# Altium schematic sheet OMODRI_Encoders.SchDoc
size A3; Date: Not shown in title block; ApprovedBy: Not shown in title block; CheckedBy: Not shown in title block; Author: Not shown in title block; CompanyName: Not shown in title block; Engineer: Not shown in title block; Organization: Not shown in title block; Address1: Not shown in title block; Address2: Not shown in title block; Address3: Not shown in title block; Address4: Not shown in title block; DocumentNumber: 1; Revision: Use project parameter SCH_Rev; SheetNumber: 3; SheetTotal: 4; PageSetup: Record=PageOptions|CenterHorizontal=True|CenterVertical=True|PrintScale=1.00|XCorrection=1.00|YCorrection=1.00|PrintKind=0|BorderSize=5000000|LeftOffset=0|BottomOffset=0|Orientation=2|PaperLength=1000|PaperWidth=1000|Scale=100|PaperSource=15|PrintQuality=600|MediaType=1|DitherType=10|PaperKind=Letter|PrintScaleMode=1; CurrentTime: Not shown in title block; CurrentDate: Not shown in title block; Time: Not shown in title block; DocumentFullPathAndName: Not shown in title block; DocumentName: Not shown in title block; ModifiedDate: Not shown in title block; ImagePath: Not shown in title block
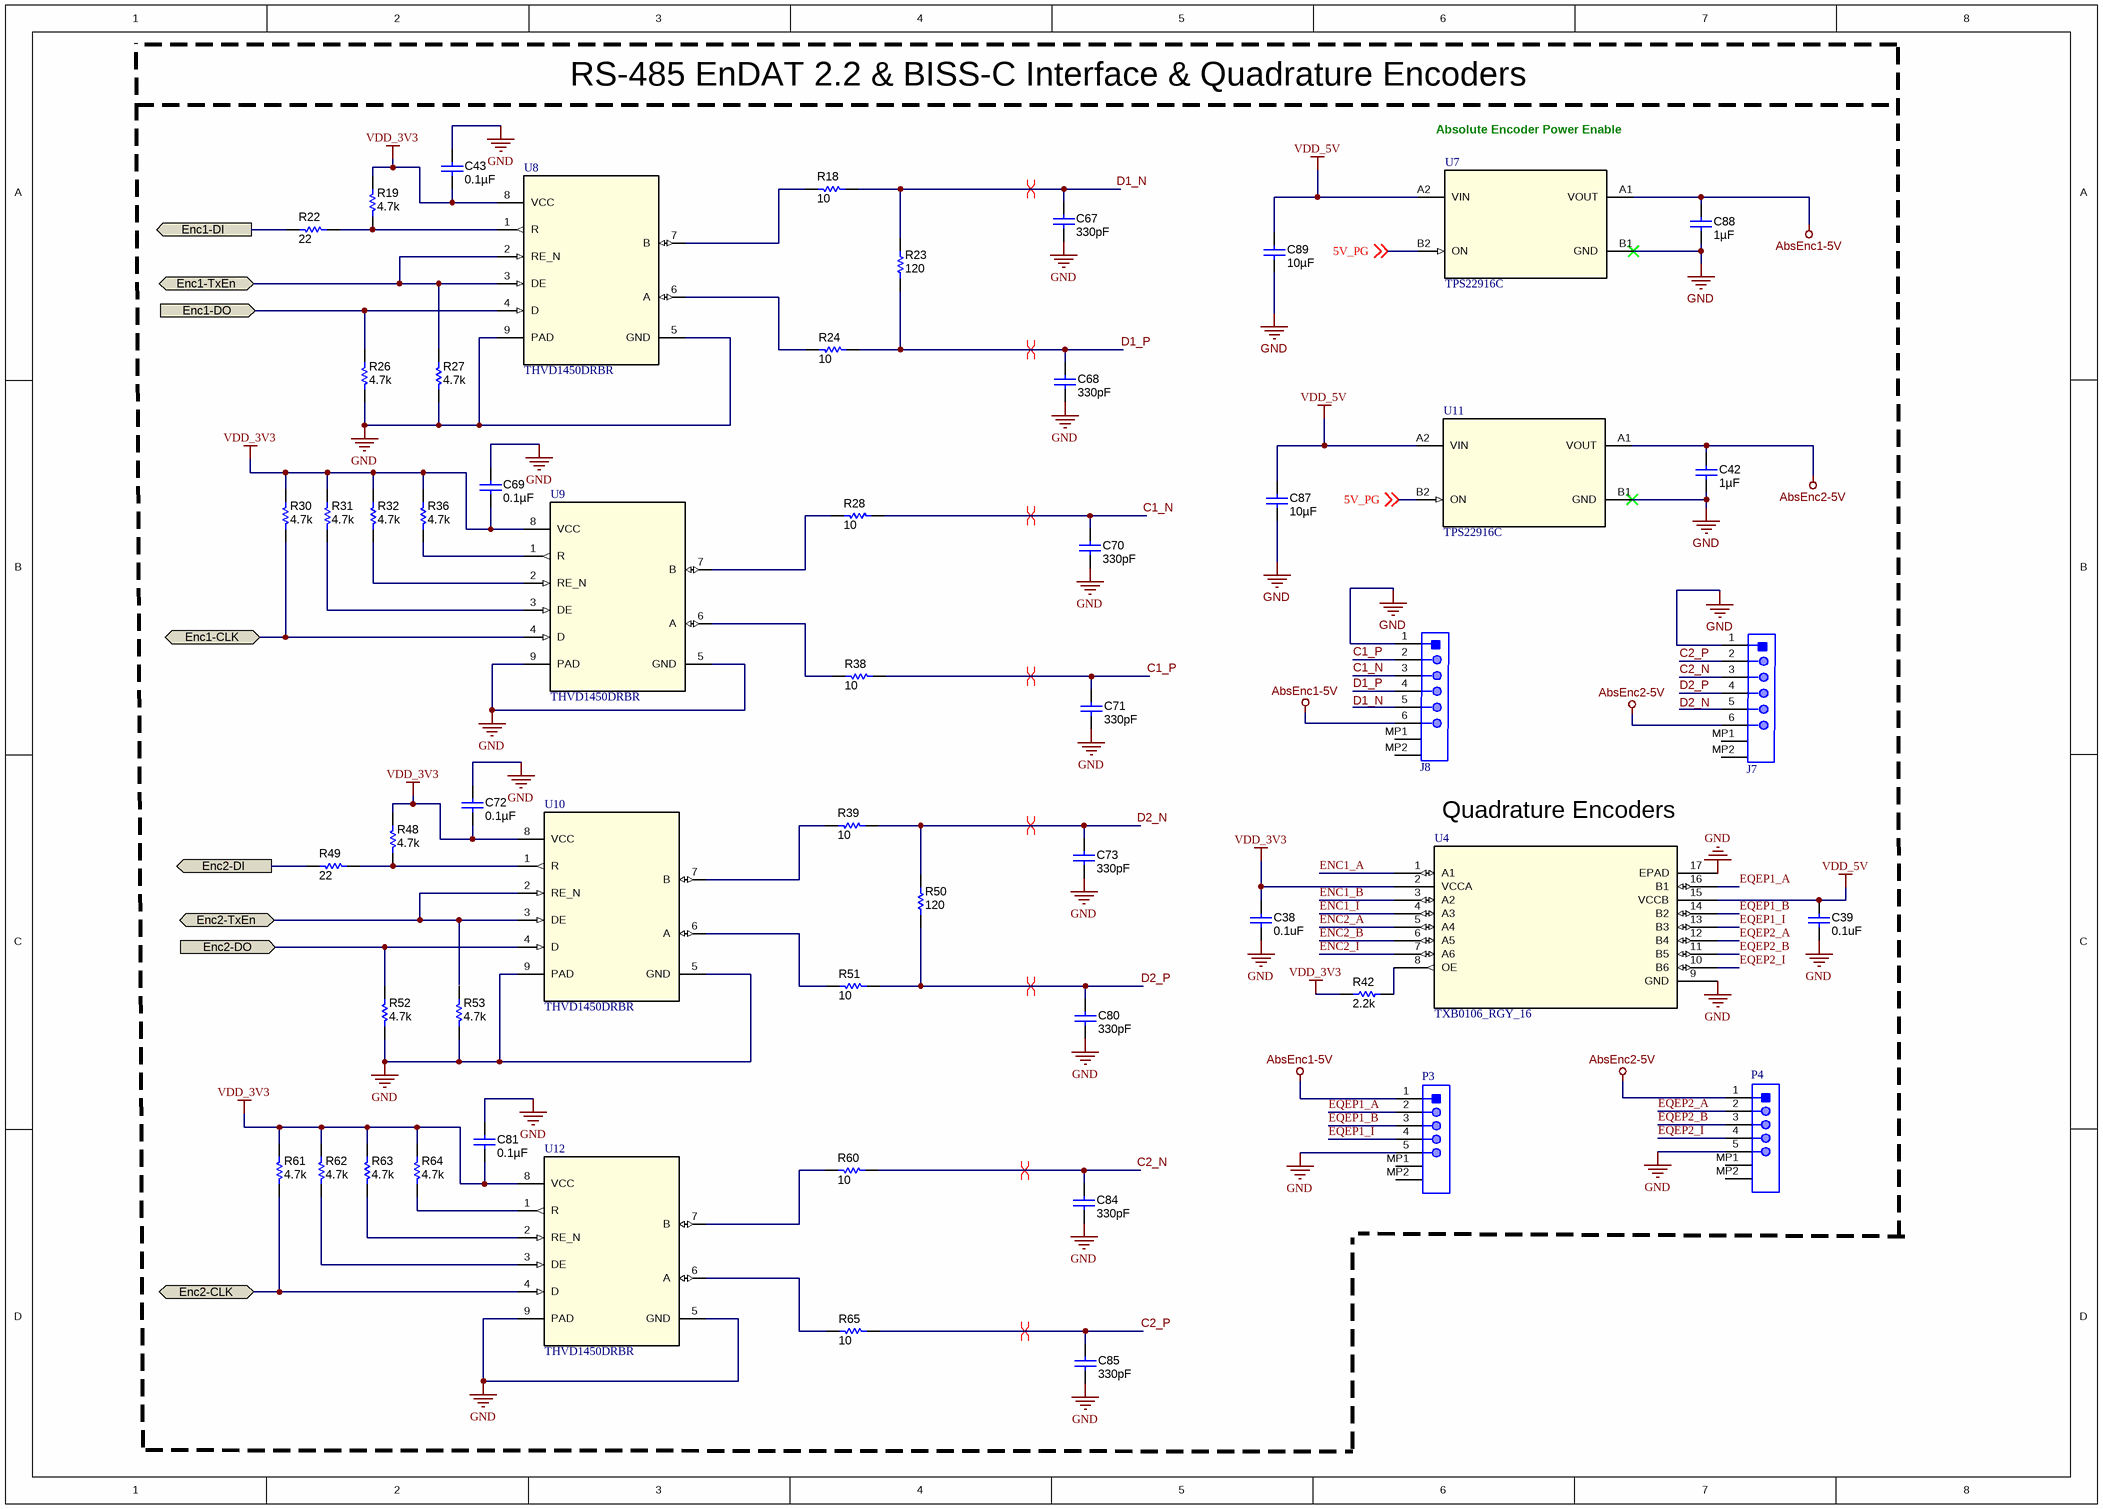
[diagram p0: OMODRI_Encoders.SchDoc]

## Parts
C38  ValueDisplayed: 0.1uF  [0402]  (hidden comment: CL05B104KP5NNNC)
C39  ValueDisplayed: 0.1uF  [0402]  (hidden comment: CL05B104KP5NNNC)
C42  ValueDisplayed: 1µF  [0805_HV]  (hidden comment: TMK212BJ105KG-T)
C43  ValueDisplayed: 0.1µF  [0603]  (hidden comment: 06033D104KAT2A)
C67  ValueDisplayed: 330pF  [0603]  (hidden comment: GRM188R71H331KA01D)
C68  ValueDisplayed: 330pF  [0603]  (hidden comment: GRM188R71H331KA01D)
C69  ValueDisplayed: 0.1µF  [0603]  (hidden comment: 06033D104KAT2A)
C70  ValueDisplayed: 330pF  [0603]  (hidden comment: GRM188R71H331KA01D)
C71  ValueDisplayed: 330pF  [0603]  (hidden comment: GRM188R71H331KA01D)
C72  ValueDisplayed: 0.1µF  [0603]  (hidden comment: 06033D104KAT2A)
C73  ValueDisplayed: 330pF  [0603]  (hidden comment: GRM188R71H331KA01D)
C80  ValueDisplayed: 330pF  [0603]  (hidden comment: GRM188R71H331KA01D)
C81  ValueDisplayed: 0.1µF  [0603]  (hidden comment: 06033D104KAT2A)
C84  ValueDisplayed: 330pF  [0603]  (hidden comment: GRM188R71H331KA01D)
C85  ValueDisplayed: 330pF  [0603]  (hidden comment: GRM188R71H331KA01D)
C87  ValueDisplayed: 10µF  [0805_HV]  (hidden comment: GRM21BR61E106KA73L)
C88  ValueDisplayed: 1µF  [0805_HV]  (hidden comment: TMK212BJ105KG-T)
C89  ValueDisplayed: 10µF  [0805_HV]  (hidden comment: GRM21BR61E106KA73L)
J7  Conn_JST_BM06B-GHS-TBT_LF_SN_N_eec  [JST_BM06B-GHS-TBT_LF_SN_N_0]  (value not drawn)
J8  Conn_JST_BM06B-GHS-TBT_LF_SN_N_eec  [JST_BM06B-GHS-TBT_LF_SN_N_0]  (value not drawn)
P3  BM05B-GHS-TBT(LF)(SN)  [JST-BM05B-GHS-TBT_V]  (value not drawn)
P4  BM05B-GHS-TBT(LF)(SN)  [JST-BM05B-GHS-TBT_V]  (value not drawn)
R18  value 10  [0603]  (hidden comment: CRCW060310R0JNEAHP)
R19  value 4.7k  [0603]  (hidden comment: CRCW06034K70JNEA)
R22  value 22  [0603]  (hidden comment: CRCW060322R0JNEA)
R23  ValueDisplayed: 120  [0603]  (hidden comment: CRCW0603120RJNEA)
R24  value 10  [0603]  (hidden comment: CRCW060310R0JNEAHP)
R26  value 4.7k  [0603]  (hidden comment: CRCW06034K70JNEA)
R27  value 4.7k  [0603]  (hidden comment: CRCW06034K70JNEA)
R28  value 10  [0603]  (hidden comment: CRCW060310R0JNEAHP)
R30  value 4.7k  [0603]  (hidden comment: CRCW06034K70JNEA)
R31  value 4.7k  [0603]  (hidden comment: CRCW06034K70JNEA)
R32  value 4.7k  [0603]  (hidden comment: CRCW06034K70JNEA)
R36  value 4.7k  [0603]  (hidden comment: CRCW06034K70JNEA)
R38  value 10  [0603]  (hidden comment: CRCW060310R0JNEAHP)
R39  value 10  [0603]  (hidden comment: CRCW060310R0JNEAHP)
R42  ValueDisplayed: 2.2k  [0201]  (hidden comment: CRCW02012K20JNED)
R48  value 4.7k  [0603]  (hidden comment: CRCW06034K70JNEA)
R49  value 22  [0603]  (hidden comment: CRCW060322R0JNEA)
R50  ValueDisplayed: 120  [0603]  (hidden comment: CRCW0603120RJNEA)
R51  value 10  [0603]  (hidden comment: CRCW060310R0JNEAHP)
R52  value 4.7k  [0603]  (hidden comment: CRCW06034K70JNEA)
R53  value 4.7k  [0603]  (hidden comment: CRCW06034K70JNEA)
R60  value 10  [0603]  (hidden comment: CRCW060310R0JNEAHP)
R61  value 4.7k  [0603]  (hidden comment: CRCW06034K70JNEA)
R62  value 4.7k  [0603]  (hidden comment: CRCW06034K70JNEA)
R63  value 4.7k  [0603]  (hidden comment: CRCW06034K70JNEA)
R64  value 4.7k  [0603]  (hidden comment: CRCW06034K70JNEA)
R65  value 10  [0603]  (hidden comment: CRCW060310R0JNEAHP)
U4  TXB0106_RGY_16  [RGY16_2P55X2P05]
U7  TPS22916C  [YFP0004ABAB]
U8  THVD1450DRBR  [DRB0008F]
U9  THVD1450DRBR  [DRB0008F]
U10  THVD1450DRBR  [DRB0008F]
U11  TPS22916C  [YFP0004ABAB]
U12  THVD1450DRBR  [DRB0008F]

## Ports
Enc1-CLK (bidir), Enc1-DI (out), Enc1-DO (in), Enc1-TxEn (bidir), Enc2-CLK (bidir), Enc2-DI (out), Enc2-DO (in), Enc2-TxEn (bidir)

## Nets
AbsEnc1-5V: C88.1 J8.6 P3.1 U7.A1(VOUT)
AbsEnc2-5V: C42.1 J7.6 P4.1 U11.A1(VOUT)
GND: C38.2 C39.2 C42.2 C43.2 C67.1 C68.2 C69.2 C70.1 C71.2 C72.2 C73.1 C80.2 C81.2 C84.1 C85.2 C87.2 C88.2 C89.2 J7.1 J8.1 P3.5 P4.5 R26.2 R27.2 R52.2 R53.2 U4.9(GND) U4.17(EPAD) U7.B1(GND) U8.5(GND) U8.9(PAD) U9.5(GND) U9.9(PAD) U10.5(GND) U10.9(PAD) U11.B1(GND) U12.5(GND) U12.9(PAD)
VDD_3V3: C38.1 C43.1 C69.1 C72.1 C81.1 R19.2 R30.1 R31.1 R32.1 R36.1 R42.1 R48.2 R61.1 R62.1 R63.1 R64.1 U4.2(VCCA) U8.8(VCC) U9.8(VCC) U10.8(VCC) U12.8(VCC)
VDD_5V: C39.1 C87.1 C89.1 U4.15(VCCB) U7.A2(VIN) U11.A2(VIN)
5V_PG: U7.B2(ON) U11.B2(ON) ; off-sheet 5V_PG
C1_N: C70.2 J8.3 R28.1
C1_P: C71.1 J8.2 R38.1
C2_N: C84.2 J7.3 R60.1
C2_P: C85.1 J7.2 R65.1
D1_N: C67.2 R18.1 R23.2
D1_P: C68.1 J8.4 R23.1 R24.1
D2_N: C73.2 R39.1 R50.2
D2_P: C80.1 J7.4 R50.1 R51.1
Enc1-CLK: R30.2 U9.4(D) ; port Enc1-CLK
Enc1-DI: R22.2 ; port Enc1-DI
Enc1-DO: R26.1 U8.4(D) ; port Enc1-DO
Enc1-TxEn: U8.2(RE_N) U8.3(DE) ; port Enc1-TxEn
ENC1_A: U4.1(A1)
ENC1_B: U4.3(A2)
ENC1_I: U4.4(A3)
Enc2-CLK: R61.2 U12.4(D) ; port Enc2-CLK
Enc2-DI: R49.2 ; port Enc2-DI
Enc2-DO: R52.1 U10.4(D) ; port Enc2-DO
Enc2-TxEn: U10.2(RE_N) U10.3(DE) ; port Enc2-TxEn
ENC2_A: U4.5(A4)
ENC2_B: U4.6(A5)
ENC2_I: U4.7(A6)
EQEP1_A: P3.2 U4.16(B1)
EQEP1_B: P3.3 U4.14(B2)
EQEP1_I: P3.4 U4.13(B3)
EQEP2_A: P4.2 U4.12(B4)
EQEP2_B: P4.3 U4.11(B5)
EQEP2_I: P4.4 U4.10(B6)
NetR18_2: R18.2 U8.7(B)
NetR19_1: R19.1 R22.1 U8.1(R)
NetR24_2: R24.2 U8.6(A)
NetR28_2: R28.2 U9.7(B)
NetR31_2: R31.2 U9.3(DE)
NetR32_2: R32.2 U9.2(RE_N)
NetR36_2: R36.2 U9.1(R)
NetR38_2: R38.2 U9.6(A)
NetR39_2: R39.2 U10.7(B)
NetR42_2: R42.2 U4.8(OE)
NetR48_1: R48.1 R49.1 U10.1(R)
NetR51_2: R51.2 U10.6(A)
NetR60_2: R60.2 U12.7(B)
NetR62_2: R62.2 U12.3(DE)
NetR63_2: R63.2 U12.2(RE_N)
NetR64_2: R64.2 U12.1(R)
NetR65_2: R65.2 U12.6(A)

Not connected (* = marked no-connect by the designer): J7 5 MP1 MP2; J8 5 MP1 MP2; P3 MP1 MP2; P4 MP1 MP2; R27 1; R53 1

## Layout directives
differential pair: C1_N, C1_P, C2_N, C2_P, D1_N, D1_P, D2_N, D2_P

## Notes on the sheet
- RS-485 EnDAT 2.2 & BISS-C Interface & Quadrature Encoders
- Absolute Encoder Power Enable
- Quadrature Encoders
- Labels drawn without touching a wire or pin: D1_N, D2_N
- Drawn By:
- SVN Rev:
- Number:
- TID #:
- Orderable:
- Rev:
- Sheet Title:
- File:
- Project Title:
- Designed for:
- Assembly Variant:
- Mod. Date:
- Sheet:
- Size:
- of
- B
- http://www.ti.com
- Texas Instruments and/or its licensors do not warrant the accuracy or completeness of this specification or any information contained therein. Texas Instruments and/or its licensors do not warrant that this design will meet the specifications, will be suitable for your application or fit for any particular purpose, or will operate in an implementation. Texas Instruments and/or its licensors do not warrant that the design is production worthy. You should completely validate and test your design implementation to confirm the system functionality for your application.
- Engineer:
- Contact:
- © Texas Instruments

## Library data of the parts
C38 C39 = CMP-0006343-2: CAP, CERM, 0.1 uF, 10 V, +/- 10%, X7R, 0402; Manufacturer: Samsung Electro-Mechanics; Polarized: N; Value: 0.1uF; U/M: EA; Cap_F: 100nF; Value1: Unknown; VDC_V: 10V; TaMin_C: -55°C; TaMax_C: 125°C; AEC Category: Q200; SizeArea_mm2: 0.5; SizeAreaWB_mm2: 3; SizeX_mm: 1; SizeZ_mm: 0.6; CompType: Capacitor; PartNumber: CL05B104KP5NNNC; PackageReference: 0402; RoHS: Y; Tolerance_%: 10%; Value2: 10V; MountType: SMT; Technology: Ceramic; TempCo: X7R; Cap_Case: 0402; Published: 2008-06-19; Publisher: Texas Instruments; LatestRevisionDate: 2017-03-09; ComponentLink1Description: Datasheet link; ComponentLink1URL: http://www.samsungsem.com/kr/front/downloadcms.do?path=/kr/support/product-search/mlcc/__icsFiles/afieldfile/2014/11/05&fileName=S_CL05B104KP5NNNC.pdf; AEC Qualified: N; AEC Grade: N/A; SizeY_mm: 0.5
C42 C88 = TMK212BJ105KG-T: CAP, CERM, 1 µF, 20 V, +/- 10%, X5R, 0805; Manufacturer: Taiyo Yuden; Polarized: N; CompType: Capacitor; Value: 1uF; U/M: EA; Cap_F: 0.000001; Tolerance_%: 10; Value1: Unknown; VDC_V: 20; Value2: 20V; TaMin_C: -55; TaMax_C: 85; Cap_Case: 0805; SizeArea_mm2: 2.5; SizeAreaWB_mm2: 6.75; SizeX_mm: 2; SizeY_mm: 1.25; SizeZ_mm: 1.45; AEC Category: Q200; SymbolVersion: 2008-07-09; PartNumber: TMK212BJ105KG-T; PackageReference: 0805; RoHS: Y; MountType: SMT; Technology: Ceramic; TempCo: X5R; Published: 2008-06-19; Publisher: Texas Instruments; LatestRevisionDate: 2016-07-16; ComponentLink1Description: Datasheet link; ComponentLink1URL: http://www.yuden.co.jp/ut/product/pdf/djmk_e.pdf; Supplier 1: Digi-Key; Supplier Part Number 1: 587-1291-1-ND; Supplier 2: Farnell; Supplier Part Number 2: 8031575; Supplier 3: Newark; Supplier Part Number 3: 18J2754; AEC Qualified: ?
C43 C69 C72 C81 = 06033D104KAT2A: CAP, CERM, 0.1uF, 25V, +/-10%, X5R, 0603; Manufacturer: AVX; Polarized: N; CompType: Capacitor; U/M: EA; Cap_F: 0.0000001; Tolerance_%: 10; ESR_Ohm: 0.048; Value1: 0.048 ohm; VDC_V: 25; IRMS_A: 0.53; TaMin_C: -55; TaMax_C: 85; SymbolVersion: 2008-07-09; Value: 0.1uF; PartNumber: 06033D104KAT2A; PackageReference: 0603; RoHS: Y; Value2: 25V; MountType: SMT; Technology: Ceramic; TempCo: X5R; Cap_Case: 0603; Published: 2008-06-19; Publisher: Texas Instruments; LatestRevisionDate: 2014-03-28; ComponentLink1Description: Datasheet link; ComponentLink1URL: http://www.avx.com/docs/masterpubs/smccp.pdf; Supplier 1: Digi-Key; Supplier Part Number 1: 478-1244-1-ND; Supplier 2: Mouser; Supplier Part Number 2: 581-06033D104K
C67 C68 C70 C71 C73 C80 C84 C85 = GRM188R71H331KA01D: CAP, CERM, 330pF, 50V, +/-10%, X7R, 0603; Manufacturer: MuRata; Polarized: N; CompType: Capacitor; U/M: EA; Cap_F: 0.00000000033; Tolerance_%: 10; Value1: Unknown; VDC_V: 50; TaMin_C: -55; TaMax_C: 125; SymbolVersion: 2008-07-09; Value: 330pF; PartNumber: GRM188R71H331KA01D; PackageReference: 0603; RoHS: Y; Value2: 50V; MountType: SMT; Technology: Ceramic; TempCo: X7R; Cap_Case: 0603; Published: 2008-06-19; Publisher: Texas Instruments; LatestRevisionDate: 2014-03-28; ComponentLink1Description: Datasheet link; ComponentLink1URL: http://search.murata.co.jp/Ceramy/PnsearchViewAction.do?HnOFG=ON&HnNFG=ON&SEL_CNT=50&sLang=en&sKey=GRM188R71H331KA01D&x=9&y=9&search=startwith; Supplier 1: Digi-Key; Supplier Part Number 1: 490-1486-1-ND; Supplier 2: Mouser; Supplier Part Number 2: 81-GRM188R71H331KA01; Supplier 3: Farnell; Supplier Part Number 3: 1403787
C87 C89 = GRM21BR61E106KA73L: CAP, CERM, 10 µF, 25 V,+/- 10%, X5R, 0805; Manufacturer: MuRata; Polarized: N; CompType: Capacitor; Value: 10uF; U/M: EA; Cap_F: 0.00001; Tolerance_%: 10; Value1: Unknown; VDC_V: 25; Value2: 25V; TaMin_C: -55; TaMax_C: 85; Cap_Case: 0805; SizeArea_mm2: 2.5; SizeAreaWB_mm2: 6.75; SizeX_mm: 2; SizeY_mm: 1.25; SizeZ_mm: 1.45; AEC Category: Q200; Green_Lifecycle: Active; Green_REACh: Passed; SymbolVersion: 2008-07-09; PartNumber: GRM21BR61E106KA73L; PackageReference: 0805; RoHS: Y; MountType: SMT; Technology: Ceramic; TempCo: X5R; Published: 2008-06-19; Publisher: Texas Instruments; LatestRevisionDate: 2017-06-02; ComponentLink1Description: Datasheet link; ComponentLink1URL: http://www.murata.com/~/media/webrenewal/support/library/catalog/products/capacitor/mlcc/c02e.ashx; Supplier 1: Digi-Key; Supplier Part Number 1: 490-5523-1-ND; Supplier 2: Newark; Supplier Part Number 2: 24R6339; Supplier 3: Mouser; Supplier Part Number 3: 81-GRM21BR61E106KA3L; AEC Qualified: ?; Green_EU RoHS: Passed; Green_EU RoHS-2: Incomplete
J7 J8 = Conn_JST_BM06B-GHS-TBT_LF_SN_N_eec: CONN HEADER GH TOP 6POS 1.25MM; Manufacturer: JST; Part Number: BM06B-GHS-TBT(LF)(SN)(N); helpURL: https://upverter.com/upn/revision/9caaf2120726c690/; ComponentLink2Description: Datasheet; Temperature: -25°C to +85°C; Package: HDR06; Supplier 2: Mouser; Price: 0.396190066284; Supplier 1: Digi-Key; ComponentLink1URL: https://upverter.com/upn/revision/9caaf2120726c690/; Supplier Part Number 1: 455-1582-1-ND; ComponentLink1Description: Upverter; ComponentLink2URL: http://www.jst-mfg.com/product/pdf/eng/eGH.pdf; RoHS: TRUE; Temperature Range High: +85°C; Digikey Description: CONN HEADER GH TOP 6POS 1.25MM; Digikey Part Number: 455-1582-1-ND; Temperature Range Low: -25°C; Lead Free: yes
P3 P4 = CMP-2000-05958-1: GH Disconnectable Crimp Style Connector, Pitch 1.25 mm, 1 x 5 Position, Height 4.05 mm, -25 to 85 degC, RoHS, Tape and Reel; Manufacturer: JST; No of Positions: 5; Pitch: 1.25mm; Style/Orientation: StraightHeader/Plug; Package Reference: BM05B-GHS-TBT; Type: WiretoBoard; Datasheet URL: http://www.jst-mfg.com/product/pdf/eng/eGH.pdf; Termination: Crimp; Manufacturer URL: http://www.jst.com/home2.html; Mounting Technology: SurfaceMount; Datasheet Version: 05/2016; Package Description: GH Disconnectable Crimp Style Connector, Pitch 1.25 mm, 1 x 5 Position, Height 4.05 mm
R18 R24 R28 R38 R39 R51 R60 R65 = CRCW060310R0JNEAHP: RES, 10 ohm, 5%, 0.25W, 0603; Manufacturer: Vishay-Dale; CompType: Resistor; Value_Code: 10R0; Tolerance_%: 5; Power_W: 0.25; VDC_V: 75; TempCo: 200 ppm/C; EIA_Code: E24; U/M: EA; SymbolVersion: 2009-05-29; PartNumber: CRCW060310R0JNEAHP; PackageReference: 0603; RoHS: Y; Res_ohm: 10; Value1: 5%; Value2: 0.25W; MountType: SMT; Technology: Thick Film; Published: 2008-06-26; Publisher: Texas Instruments; LatestRevisionDate: 2014-03-15; ComponentLink1Description: Datasheet link; ComponentLink1URL: http://www.vishay.com/docs/20043/crcwhpe3.pdf; Supplier 1: Digi-Key; Supplier Part Number 1: 541-10SACT-ND; Supplier 2: Mouser; Supplier Part Number 2: 71-CRCW060310R0JNEAH; Supplier 3: Farnell; Supplier Part Number 3: 24T7074
R19 R26 R27 R30-R32 R36 R48 R52 R53 R61-R64 = CRCW06034K70JNEA: RES, 4.7k ohm, 5%, 0.1W, 0603; Manufacturer: Vishay-Dale; CompType: Resistor; Res_ohm: 4700; Value_Code: 4k70; Tolerance_%: 5; Power_W: 0.1; VDC_V: 75; TempCo: 200 ppm/C; EIA_Code: E24; U/M: EA; SymbolVersion: 2009-05-29; PartNumber: CRCW06034K70JNEA; PackageReference: 0603; RoHS: Y; Value1: 5%; Value2: 0.1W; MountType: SMT; Technology: Thick Film; Published: 2008-06-26; Publisher: Texas Instruments; LatestRevisionDate: 2014-03-15; ComponentLink1Description: Datasheet link; ComponentLink1URL: http://www.vishay.com/docs/20035/dcrcwe3.pdf; Supplier 1: Mouser; Supplier Part Number 1: 71-CRCW0603J-4.7K-E3; Supplier 2: Farnell; Supplier Part Number 2: 1652884; Supplier 3: Newark; Supplier Part Number 3: 59M6811
R22 R49 = CRCW060322R0JNEA: RES, 22 ohm, 5%, 0.1W, 0603; Manufacturer: Vishay-Dale; CompType: Resistor; Value_Code: 22R0; Tolerance_%: 5; Power_W: 0.1; VDC_V: 75; TempCo: 200 ppm/C; EIA_Code: E24; U/M: EA; SymbolVersion: 2009-05-29; PartNumber: CRCW060322R0JNEA; PackageReference: 0603; RoHS: Y; Res_ohm: 22; Value1: 5%; Value2: 0.1W; MountType: SMT; Technology: Thick Film; Published: 2008-06-26; Publisher: Texas Instruments; LatestRevisionDate: 2014-04-07; ComponentLink1Description: Datasheet link; ComponentLink1URL: http://www.vishay.com/docs/20035/dcrcwe3.pdf; Supplier 1: Digi-Key; Supplier Part Number 1: 541-22GCT-ND; Supplier 2: Mouser; Supplier Part Number 2: 71-CRCW0603J-22-E3; Supplier 3: Farnell; Supplier Part Number 3: 1692521
R23 R50 = CRCW0603120RJNEA: RES, 120, 5%, 0.1 W, 0603; Manufacturer: Vishay-Dale; CompType: Resistor; Value: 120; Value_Code: 120R; Tolerance_%: 5; Power_W: 0.1; Value2: 0.1W; VDC_V: 75; TempCo: 200 ppm/C; SizeArea_mm2: 1.28; SizeX_mm: 1.6; SizeY_mm: 0.8; SizeZ_mm: 1; EIA_Code: E24; U/M: EA; AEC Category: Q200; SymbolVersion: 2009-05-29; PartNumber: CRCW0603120RJNEA; PackageReference: 0603; RoHS: Y; Res_ohm: 120; Value1: 5%; MountType: SMT; Technology: Thick Film; Published: 2008-06-26; Publisher: Texas Instruments; LatestRevisionDate: 2016-06-29; ComponentLink1Description: Datasheet link; ComponentLink1URL: http://www.vishay.com/docs/20035/dcrcwe3.pdf; Supplier 1: Digi-Key; Supplier Part Number 1: 541-120GCT-ND; Supplier 2: Mouser; Supplier Part Number 2: 71-CRCW0603J-120-E3; Supplier 3: Farnell; Supplier Part Number 3: 1514716; AEC Qualified: ?
R42 = CMP-0027010-2: RES, 2.2 k, 5%, 0.05 W, 0201; Manufacturer: Vishay-Dale; Power_W: 50mW; TempCo: 200 ppm/C; Value_Code: 2k20; Value: 2.2k; EIA_Code: E24; SizeX_mm: 0.6; SizeY_mm: 0.3; SizeZ_mm: 0.26; Value2: 0.05W; SizeArea_mm2: 0.18; AEC Qualified: N; VDC_V: 30V; AEC Category: Q200; ComponentLink1URL: http://www.vishay.com/docs/20052/crcw0201e3.pdf; Supplier Part Number 2: 48P7324; Supplier 2: Newark; Supplier Part Number 3: 71-CRCW02012K20JNED; Supplier 3: Mouser; RoHS: E; Value1: 5%; MountType: SMT; Supplier 1: Digi-Key; PackageReference: 0201; Tolerance_%: 5%; Res_ohm: 2.2k; CompType: Resistor; PartNumber: CRCW02012K20JNED; ComponentLink1Description: Datasheet link; AEC Grade: N/A; Supplier Part Number 1: 541-2.2KAGCT-ND; Technology: Thick Film
U4 = TXB0106_RGY_16: Vendor: Texas Instruments; PACKAGE_DESIGNATOR: RGY; PIN_COUNT: 16; FAMILY_NAME: AUTO DIRECTION SENSING DUAL SUPPLY TRANSLATOR; INDUSTRY_STD_PKG_TYPE: VQFN; Manufacturer_Part_Number: txb0106_rgy_16; GENERIC_PART_NUMBER: TXB0106; Manufacturer: Texas Instruments; Datasheet_URL: http://www.ti.com/lit/gpn/TXB0106; Value: Value; Type: Type; RefDes: RefDes
U7 U11 = TPS22916C: TPS22916CY Single-Channel Ultra-Low Leakage Load Switch 2A 60 mO 1V to 5.5V 4-Pin DSBGA T/R; Manufacturer: Texas Instruments; Manufacturer Part Number: TPS22916CYFPR; Number of Channels: 1; Fault Protection: Reverse Current; Output Configuration: High Side; Supplier 1: Digi-Key; RoHS: No; Stock 1: 2282; Pricing 1: 1=0,42000, 10=0,36400, 25=0,33960, 100=0,25220, 250=0,21340, 500=0,20370, 1000=0,15035 (USD); Min Operating Temperature: -40°C; Max Operating Temperature: 85°C; Packaging: Tape and Reel; Number of Outputs: 1; Max Output Current: 2A; ComponentLink1URL: http://www.ti.com/lit/ds/symlink/tps22916.pdf?src-supplier=Digi-Key; ComponentLink1Description: http://www.ti.com/lit/ds/symlink/tps22916.pdf?src-supplier=Digi-Key; Supplier Part Number 1: 296-50065-1-ND
U8-U10 U12 = THVD1450DRBR: Manufacturer: Texas Instruments; Simplex/Duplex: Half Duplex; PartNumber: THVD1450DRBR; RefDes: RefDes; TYPE: TYPE; Value: Value; Supplier 1: Mouser; Manufacturer Part Number: THVD1450DRBR; RoHS: No; Stock 1: 8004; Pricing 1: 1=2,56000, 10=2,18000, 100=1,74000, 500=1,52000, 1000=1,26000, 3000=1,17000, 6000=1,13000, 9000=1,08000 (USD); Min Operating Temperature: -40°C; Max Operating Temperature: 125°C; Supplier Part Number 1: 595-THVD1450DRBR